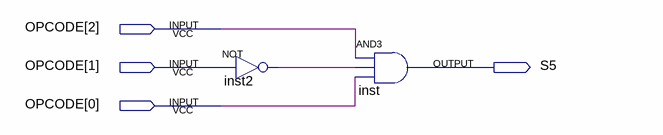
[diagram p0: schematic sheet]
// Quartus schematic DecoAND.bdf as structural Verilog: 2 symbols, 4 pins
module DecoAND (
  input  [2:0] OPCODE,
  output S5
);

  wire inst2_out;

  not inst2 (inst2_out, OPCODE[1]);
  and inst (S5, OPCODE[2], inst2_out, OPCODE[0]);
endmodule
